# Altium schematic sheet 05-Front Panel SFP+.SchDoc
size Tabloid; Customer: 01910; SheetNumber: 5; SheetTotal: 20
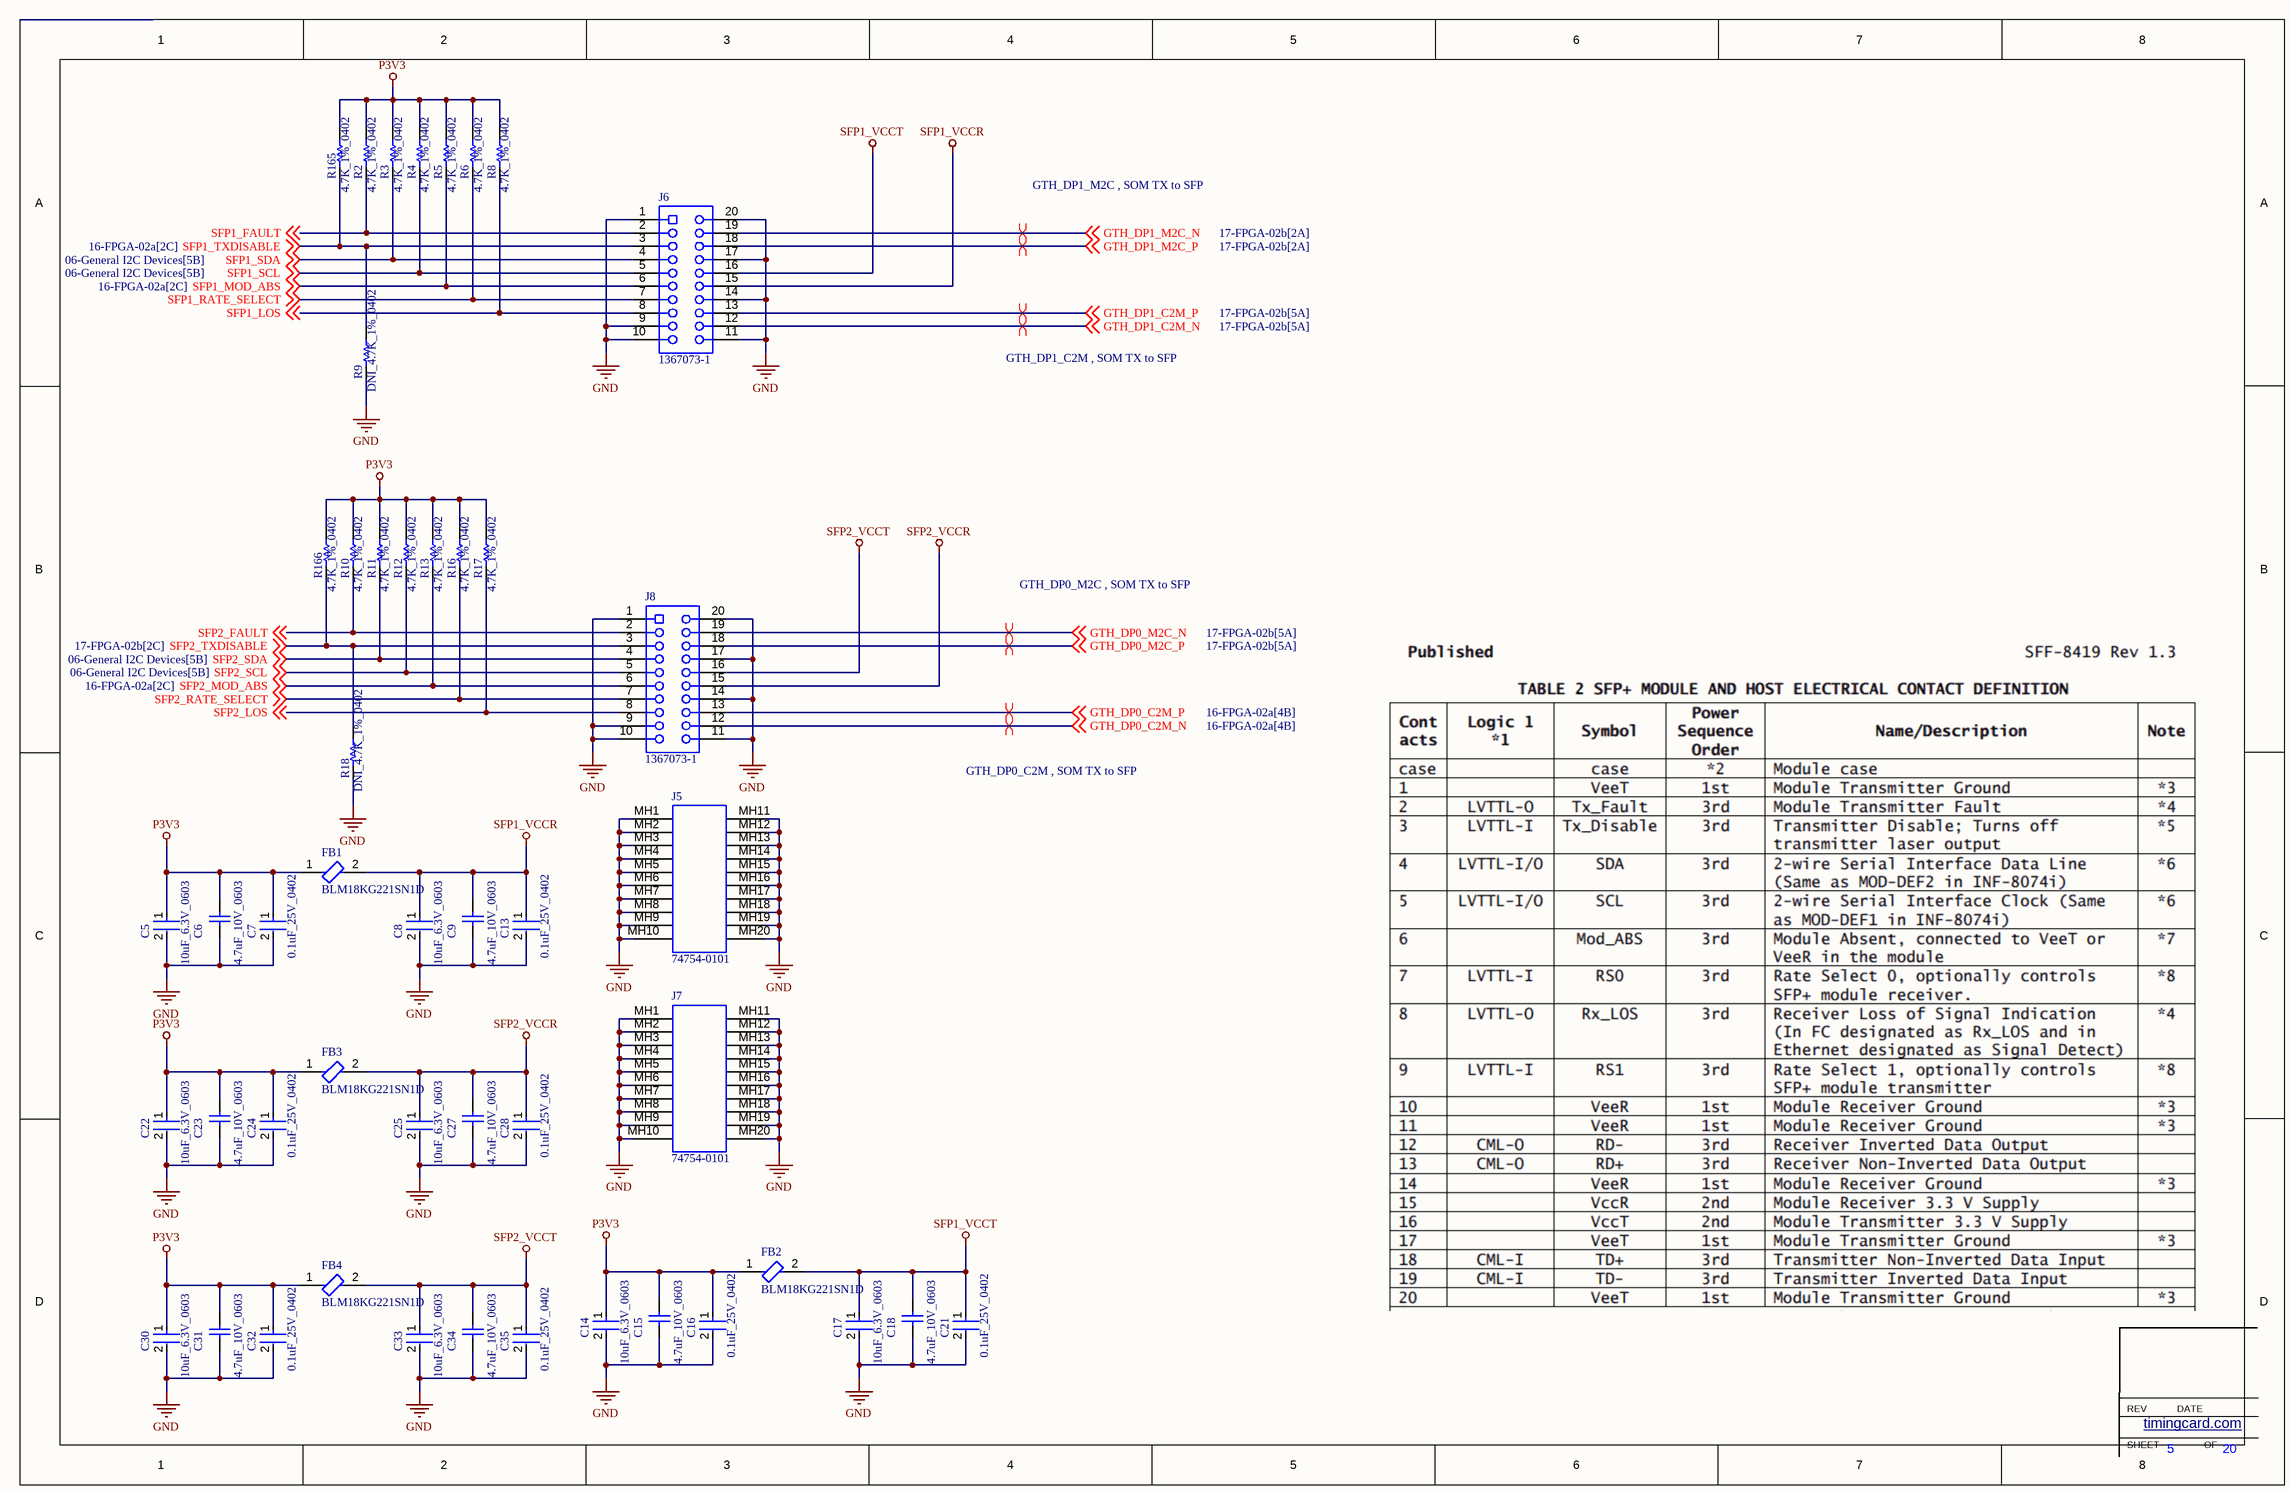
[diagram p0: 05-Front Panel SFP+.SchDoc]

## Parts
C5  10uF_6.3V_0603  [FP-C0603C106M9PACTU-MFG]
C6  4.7uF_10V_0603  [CAPC1608X87X35NL15T15]
C7  0.1uF_25V_0402  [FP-0402-L_1_0_1-W_0_5_0_1-IPC_C]
C8  10uF_6.3V_0603  [FP-C0603C106M9PACTU-MFG]
C9  4.7uF_10V_0603  [CAPC1608X87X35NL15T15]
C13  0.1uF_25V_0402  [FP-0402-L_1_0_1-W_0_5_0_1-IPC_C]
C14  10uF_6.3V_0603  [FP-C0603C106M9PACTU-MFG]
C15  4.7uF_10V_0603  [CAPC1608X87X35NL15T15]
C16  0.1uF_25V_0402  [FP-0402-L_1_0_1-W_0_5_0_1-IPC_C]
C17  10uF_6.3V_0603  [FP-C0603C106M9PACTU-MFG]
C18  4.7uF_10V_0603  [CAPC1608X87X35NL15T15]
C21  0.1uF_25V_0402  [FP-0402-L_1_0_1-W_0_5_0_1-IPC_C]
C22  10uF_6.3V_0603  [FP-C0603C106M9PACTU-MFG]
C23  4.7uF_10V_0603  [CAPC1608X87X35NL15T15]
C24  0.1uF_25V_0402  [FP-0402-L_1_0_1-W_0_5_0_1-IPC_C]
C25  10uF_6.3V_0603  [FP-C0603C106M9PACTU-MFG]
C27  4.7uF_10V_0603  [CAPC1608X87X35NL15T15]
C28  0.1uF_25V_0402  [FP-0402-L_1_0_1-W_0_5_0_1-IPC_C]
C30  10uF_6.3V_0603  [FP-C0603C106M9PACTU-MFG]
C31  4.7uF_10V_0603  [CAPC1608X87X35NL15T15]
C32  0.1uF_25V_0402  [FP-0402-L_1_0_1-W_0_5_0_1-IPC_C]
C33  10uF_6.3V_0603  [FP-C0603C106M9PACTU-MFG]
C34  4.7uF_10V_0603  [CAPC1608X87X35NL15T15]
C35  0.1uF_25V_0402  [FP-0402-L_1_0_1-W_0_5_0_1-IPC_C]
FB1  BLM18KG221SN1D  [FP-BLM18-0_15-t0_8-IPC_B]
FB2  BLM18KG221SN1D  [FP-BLM18-0_15-t0_8-IPC_B]
FB3  BLM18KG221SN1D  [FP-BLM18-0_15-t0_8-IPC_B]
FB4  BLM18KG221SN1D  [FP-BLM18-0_15-t0_8-IPC_B]
J5  74754-0101  [MOLX-74754-0101_V]
J6  1367073-1  [TECO-1367073-1_V]
J7  74754-0101  [MOLX-74754-0101_V]
J8  1367073-1  [TECO-1367073-1_V]
R2  4.7K_1%_0402  [RESC1005X40X25NL10T10]
R3  4.7K_1%_0402  [RESC1005X40X25NL10T10]
R4  4.7K_1%_0402  [RESC1005X40X25NL10T10]
R5  4.7K_1%_0402  [RESC1005X40X25NL10T10]
R6  4.7K_1%_0402  [RESC1005X40X25NL10T10]
R8  4.7K_1%_0402  [RESC1005X40X25NL10T10]
R9  DNI_4.7K_1%_0402  [RESC1005X40X25NL10T10]  (no BOM)
R10  4.7K_1%_0402  [RESC1005X40X25NL10T10]
R11  4.7K_1%_0402  [RESC1005X40X25NL10T10]
R12  4.7K_1%_0402  [RESC1005X40X25NL10T10]
R13  4.7K_1%_0402  [RESC1005X40X25NL10T10]
R16  4.7K_1%_0402  [RESC1005X40X25NL10T10]
R17  4.7K_1%_0402  [RESC1005X40X25NL10T10]
R18  DNI_4.7K_1%_0402  [RESC1005X40X25NL10T10]  (no BOM)
R165  4.7K_1%_0402  [RESC1005X40X25NL10T10]
R166  4.7K_1%_0402  [RESC1005X40X25NL10T10]

## Nets
GND: C5.2 C6.1 C7.2 C8.2 C9.1 C13.2 C14.2 C15.1 C16.2 C17.2 C18.1 C21.2 C22.2 C23.1 C24.2 C25.2 C27.1 C28.2 C30.2 C31.1 C32.2 C33.2 C34.1 C35.2 J5.MH1 J5.MH2 J5.MH3 J5.MH4 J5.MH5 J5.MH6 J5.MH7 J5.MH8 J5.MH9 J5.MH10 J5.MH11 J5.MH12 J5.MH13 J5.MH14 J5.MH15 J5.MH16 J5.MH17 J5.MH18 J5.MH19 J5.MH20 J6.1 J6.9 J6.10 J6.11 J6.14 J6.17 J6.20 J7.MH1 J7.MH2 J7.MH3 J7.MH4 J7.MH5 J7.MH6 J7.MH7 J7.MH8 J7.MH9 J7.MH10 J7.MH11 J7.MH12 J7.MH13 J7.MH14 J7.MH15 J7.MH16 J7.MH17 J7.MH18 J7.MH19 J7.MH20 J8.1 J8.9 J8.10 J8.11 J8.14 J8.17 J8.20 R9.2 R18.2
P3V3: C5.1 C6.2 C7.1 C14.1 C15.2 C16.1 C22.1 C23.2 C24.1 C30.1 C31.2 C32.1 FB1.1 FB2.1 FB3.1 FB4.1 R2.1 R3.1 R4.1 R5.1 R6.1 R8.1 R10.1 R11.1 R12.1 R13.1 R16.1 R17.1 R165.1 R166.1
SFP1_VCCR: C8.1 C9.2 C13.1 FB1.2 J6.15
SFP1_VCCT: C17.1 C18.2 C21.1 FB2.2 J6.16
SFP2_VCCR: C25.1 C27.2 C28.1 FB3.2 J8.15
SFP2_VCCT: C33.1 C34.2 C35.1 FB4.2 J8.16
GTH_DP0_C2M_N: J8.12 ; off-sheet GTH_DP0_C2M_N
GTH_DP0_C2M_P: J8.13 ; off-sheet GTH_DP0_C2M_P
GTH_DP0_M2C_N: J8.19 ; off-sheet GTH_DP0_M2C_N
GTH_DP0_M2C_P: J8.18 ; off-sheet GTH_DP0_M2C_P
GTH_DP1_C2M_N: J6.12 ; off-sheet GTH_DP1_C2M_N
GTH_DP1_C2M_P: J6.13 ; off-sheet GTH_DP1_C2M_P
GTH_DP1_M2C_N: J6.19 ; off-sheet GTH_DP1_M2C_N
GTH_DP1_M2C_P: J6.18 ; off-sheet GTH_DP1_M2C_P
SFP1_FAULT: J6.2 R2.2 ; off-sheet SFP1_FAULT
SFP1_LOS: J6.8 R8.2 ; off-sheet SFP1_LOS
SFP1_MOD_ABS: J6.6 R5.2 ; off-sheet SFP1_MOD_ABS
SFP1_RATE_SELECT: J6.7 R6.2 ; off-sheet SFP1_RATE_SELECT
SFP1_SCL: J6.5 R4.2 ; off-sheet SFP1_SCL
SFP1_SDA: J6.4 R3.2 ; off-sheet SFP1_SDA
SFP1_TXDISABLE: J6.3 R9.1 R165.2 ; off-sheet SFP1_TXDISABLE
SFP2_FAULT: J8.2 R10.2 ; off-sheet SFP2_FAULT
SFP2_LOS: J8.8 R17.2 ; off-sheet SFP2_LOS
SFP2_MOD_ABS: J8.6 R13.2 ; off-sheet SFP2_MOD_ABS
SFP2_RATE_SELECT: J8.7 R16.2 ; off-sheet SFP2_RATE_SELECT
SFP2_SCL: J8.5 R12.2 ; off-sheet SFP2_SCL
SFP2_SDA: J8.4 R11.2 ; off-sheet SFP2_SDA
SFP2_TXDISABLE: J8.3 R18.1 R166.2 ; off-sheet SFP2_TXDISABLE

## Layout directives
differential pair: GTH_DP0_C2M_N, GTH_DP0_C2M_P, GTH_DP0_M2C_N, GTH_DP0_M2C_P, GTH_DP1_C2M_N, GTH_DP1_C2M_P, GTH_DP1_M2C_N, GTH_DP1_M2C_P

## Notes on the sheet
- GTH_DP1_M2C , SOM TX to SFP
- GTH_DP1_C2M , SOM TX to SFP
- GTH_DP0_M2C , SOM TX to SFP
- GTH_DP0_C2M , SOM TX to SFP
- SHEET
- REV
- timingcard.com <http://timingcard.com>
- DATE
- OF

## Library data of the parts
C5 C8 C14 C17 C22 C25 C30 C33 = CMP-2006-02285-3: CAP CER 10UF 6.3V X5R 0603; Manufacturer Part Number: C0603C106M9PACTU; Manufacturer: Kemet; Material: Ceramic; Temperature Coefficient: 15%; Tolerance: 20%; Category: Cap; Height: 0.9mm; Digikey Description: CAP CER 10UF 6.3V X5R 0603; Mouser Description: In a Pack of 10, KEMET 0603 (1608M) 10µF MLCC 6.3V dc ±20% SMD C0603C106M9PACTU; Voltage Rating: 6.3V; Device Class L2: Capacitors; Temperature Range Low: -55°C; Temperature Characteristic: X5R; ComponentLink2Description: Datasheet; Ipc Land Pattern Name: CAPC16080X80; ComponentLink2URL: http://www.kemet.com/Lists/ProductCatalog/Attachments/19/KEM_C1006_X5R_SMD.pdf; Capacitance: 10uF; Temperature Range High: +85°C; Device Class L3: Ceramic Capacitors; RoHS: TRUE; Automotive: No; Value: 10uF; Temperature: -55°C to +85°C; Device Class L1: Passive Components; Package: C0603C106M9PACTU; Lead Free: Yes; Octopart: https://octopart.com/c0603c106m9pactu-kemet-8375727
C6 C9 C15 C18 C23 C27 C31 C34 = CMP-2006-03238-1: Part Number: C0603C475K8PACTU; Manufacturer: Kemet
C7 C13 C16 C21 C24 C28 C32 C35 = CMP-2008-02519-2: General Purpose Ceramic Capacitor, 0402, 100nF, 10%, X7R, 15%, 25V; Package Quantity: 1; Capacitance: 100nF; Min Operating Temperature: -55°C; Voltage: 25V; Voltage Rating: 25V; Construction: Flat; Max Operating Temperature: 125°C; Radiation Hardening: No; Depth: 0.5mm; Thickness: 0.022inch; Voltage Rating (DC): 25V; Number of Pins: 2; Lead Free: Lead Free; Series: -; REACH SVHC: No SVHC; Length: 1mm; Dielectric: X7R; RoHS Compliant: Yes; Mount: Surface Mount; Packaging: Tape and Reel; Case/Package: 0402; Case Code (Imperial): 0402; Termination: SMD/SMT; Width: 0.02inch; Case Code (Metric): 1005; Tolerance: 10%
FB1-FB4 = CMP-0686-00556-7: Chip Ferrite Bead, 0603, 220Ω @ 100MHz, 0.05Ω, 25%, 2.2A; DC Resistance (DCR): 50mR; Number of Circuits: 1; Impedance: 220R; Current Rating: 2.2A; Material: Ferrite; Test Frequency: 100MHz; Depth: 0.8mm; Series: BLM18K; RoHS Compliant: Yes; Termination: SMD/SMT; Max Current Rating: 2.2A; Case Code (Metric): 1608; Radiation Hardening: No; Number of Pins: 2; Length: 1.6mm; Lead Free: Lead Free; Package Quantity: 1; Height: 0.8mm; Core Material: Ferrite; Inductor Type: FERRITE BEAD; Min Operating Temperature: -55°C; Case/Package: 0603; Case Code (Imperial): 0603; Number of Lines: 1; Packaging: Tape and Reel; REACH SVHC: No SVHC; Max Operating Temperature: 125°C; Military Standard: Not; DC Resistance-Max: 50mR; Width: 0.8mm; DC Current: 2.2A; Max DC Current: 2.2A; Tolerance: 25%; Weight: 7.1E-05oz
J5 J7 = CMP-1704-00003-3: SFP+ Cage, Single Port, Height 10.85 mm, Tail Height 3.05 mm, -40 to 85 degC, RoHS, Tray; RoHSCompliant: True; ComponentLink3URL: http://www.molex.com/pdm_docs/sd/747540101_sd.pdf; Width: 49 mm; Height: 10.85 mm; Mounting Technology: Through Hole; ComponentLink2Description: Datasheet; ComponentLink3Description: Package Specification; DatasheetVersion: Rev. Jul-15; Package Quantity: 1152; PackageDescription: SFP+ Cage, Single Port, Height 10.85 mm, Tail Height 3.05 mm; Radiation Hardening: No; PackageVersion: Rev. J, 02/2015; ComponentLink1Description: Manufacturer URL; PartNumber: 74754-0101; ComponentLink1URL: http://www.molex.com/; Packaging: Tray; Length: 15.9 mm; ComponentLink2URL: http://www.molex.com/webdocs/datasheets/pdf/en-us/0747540101_IO_CONNECTORS.pdf
J6 J8 = CMP-2000-05488-1: Female Connector, Pitch 0.8 mm, 2 x 10 Position, Height 5.4 mm, -55 to 85 degC, RoHS, Tape and Reel; Manufacturer: TE Connectivity; Product Training Modules: HighSpeedPluggableI/OSolutions; 3D Model: 1367073-1.pdf; Connector Type: SFP; Other Names: A97430DKR; Mating Products: 516-2084-ND / -TXRXOPTICALSFF1.25GBDISCSI; Dynamic Catalog: SFPConnectors; Featured Product: HighSpeedPluggableI-OSolutions; Connector Style: Receptacle; Associated Product: A103997CT-ND / -CONNSFPCAGESINGLEW/OPIPE / A103997TR-ND / -CONNSFPCAGESINGLEW/OPIPE / 1367645-3-ND / -CONNCAGE&HEATSINKSGLPORTTIN / 1367645-2-ND / -CONNCAGE&HEATSINKSGLPORTTIN / 1888424-1-ND / -CONNCAGE1X2SFPENHANCEDEMI / 1367643-1-ND / -CONNCAGESNGLPORTDBLSIDETIN / 1489962-1-ND / -CONNSFPCAGESINGLEW/OPIPE / 1367645-1-ND / -CONNCAGE&HEATSINKSGLPORTTIN / A99375-ND / -CONNSFPCAGE1X4PIN-IN-PASTE / A97412CT-ND / -CONNSFPLOWERCAGEPCB / More...; Number of Positions: 20; Package Reference: 1367073-1; Package Description: Female Connector, Pitch 0.8 mm, 2 x 10 Position, Height 5.4 mm; RoHS Information: 1367073-1StatementofCompliance; Contact Finish: Gold; Datasheet URL: http://www.te.com/commerce/DocumentDelivery/DDEController?Action=showdoc&DocId=Customer+Drawing%7F1367073%7FK%7Fpdf%7FEnglish%7FENG_CD_1367073_K.pdf%7F1367073-1; Datasheet Version: Rev. K, 12/2012; Contact Finish Thickness: 15µin(0.38µm); Category: Connectors,Interconnects; Mounting Type: SurfaceMount,RightAngle; Mounting Technology: SurfaceMount; Packaging: Digi-Reel®; Manufacturer URL: http://www.te.com/; Family: PluggableConnectors; Standard Package: 1; Termination: Solder
R2-R6 R8-R13 R16-R18 R165 R166 = CMP-2002-05217-1: Manufacturer: Bourns; Part Number: CR0402-FX-4701GLF